# EasyEDA schematic Spring+ - Schematic.json
TITLE: Spring+ Avionics Control-Board; REV: 1.0; Date: 2021-11-15; Sheet: 1/1; Company: Lrocket
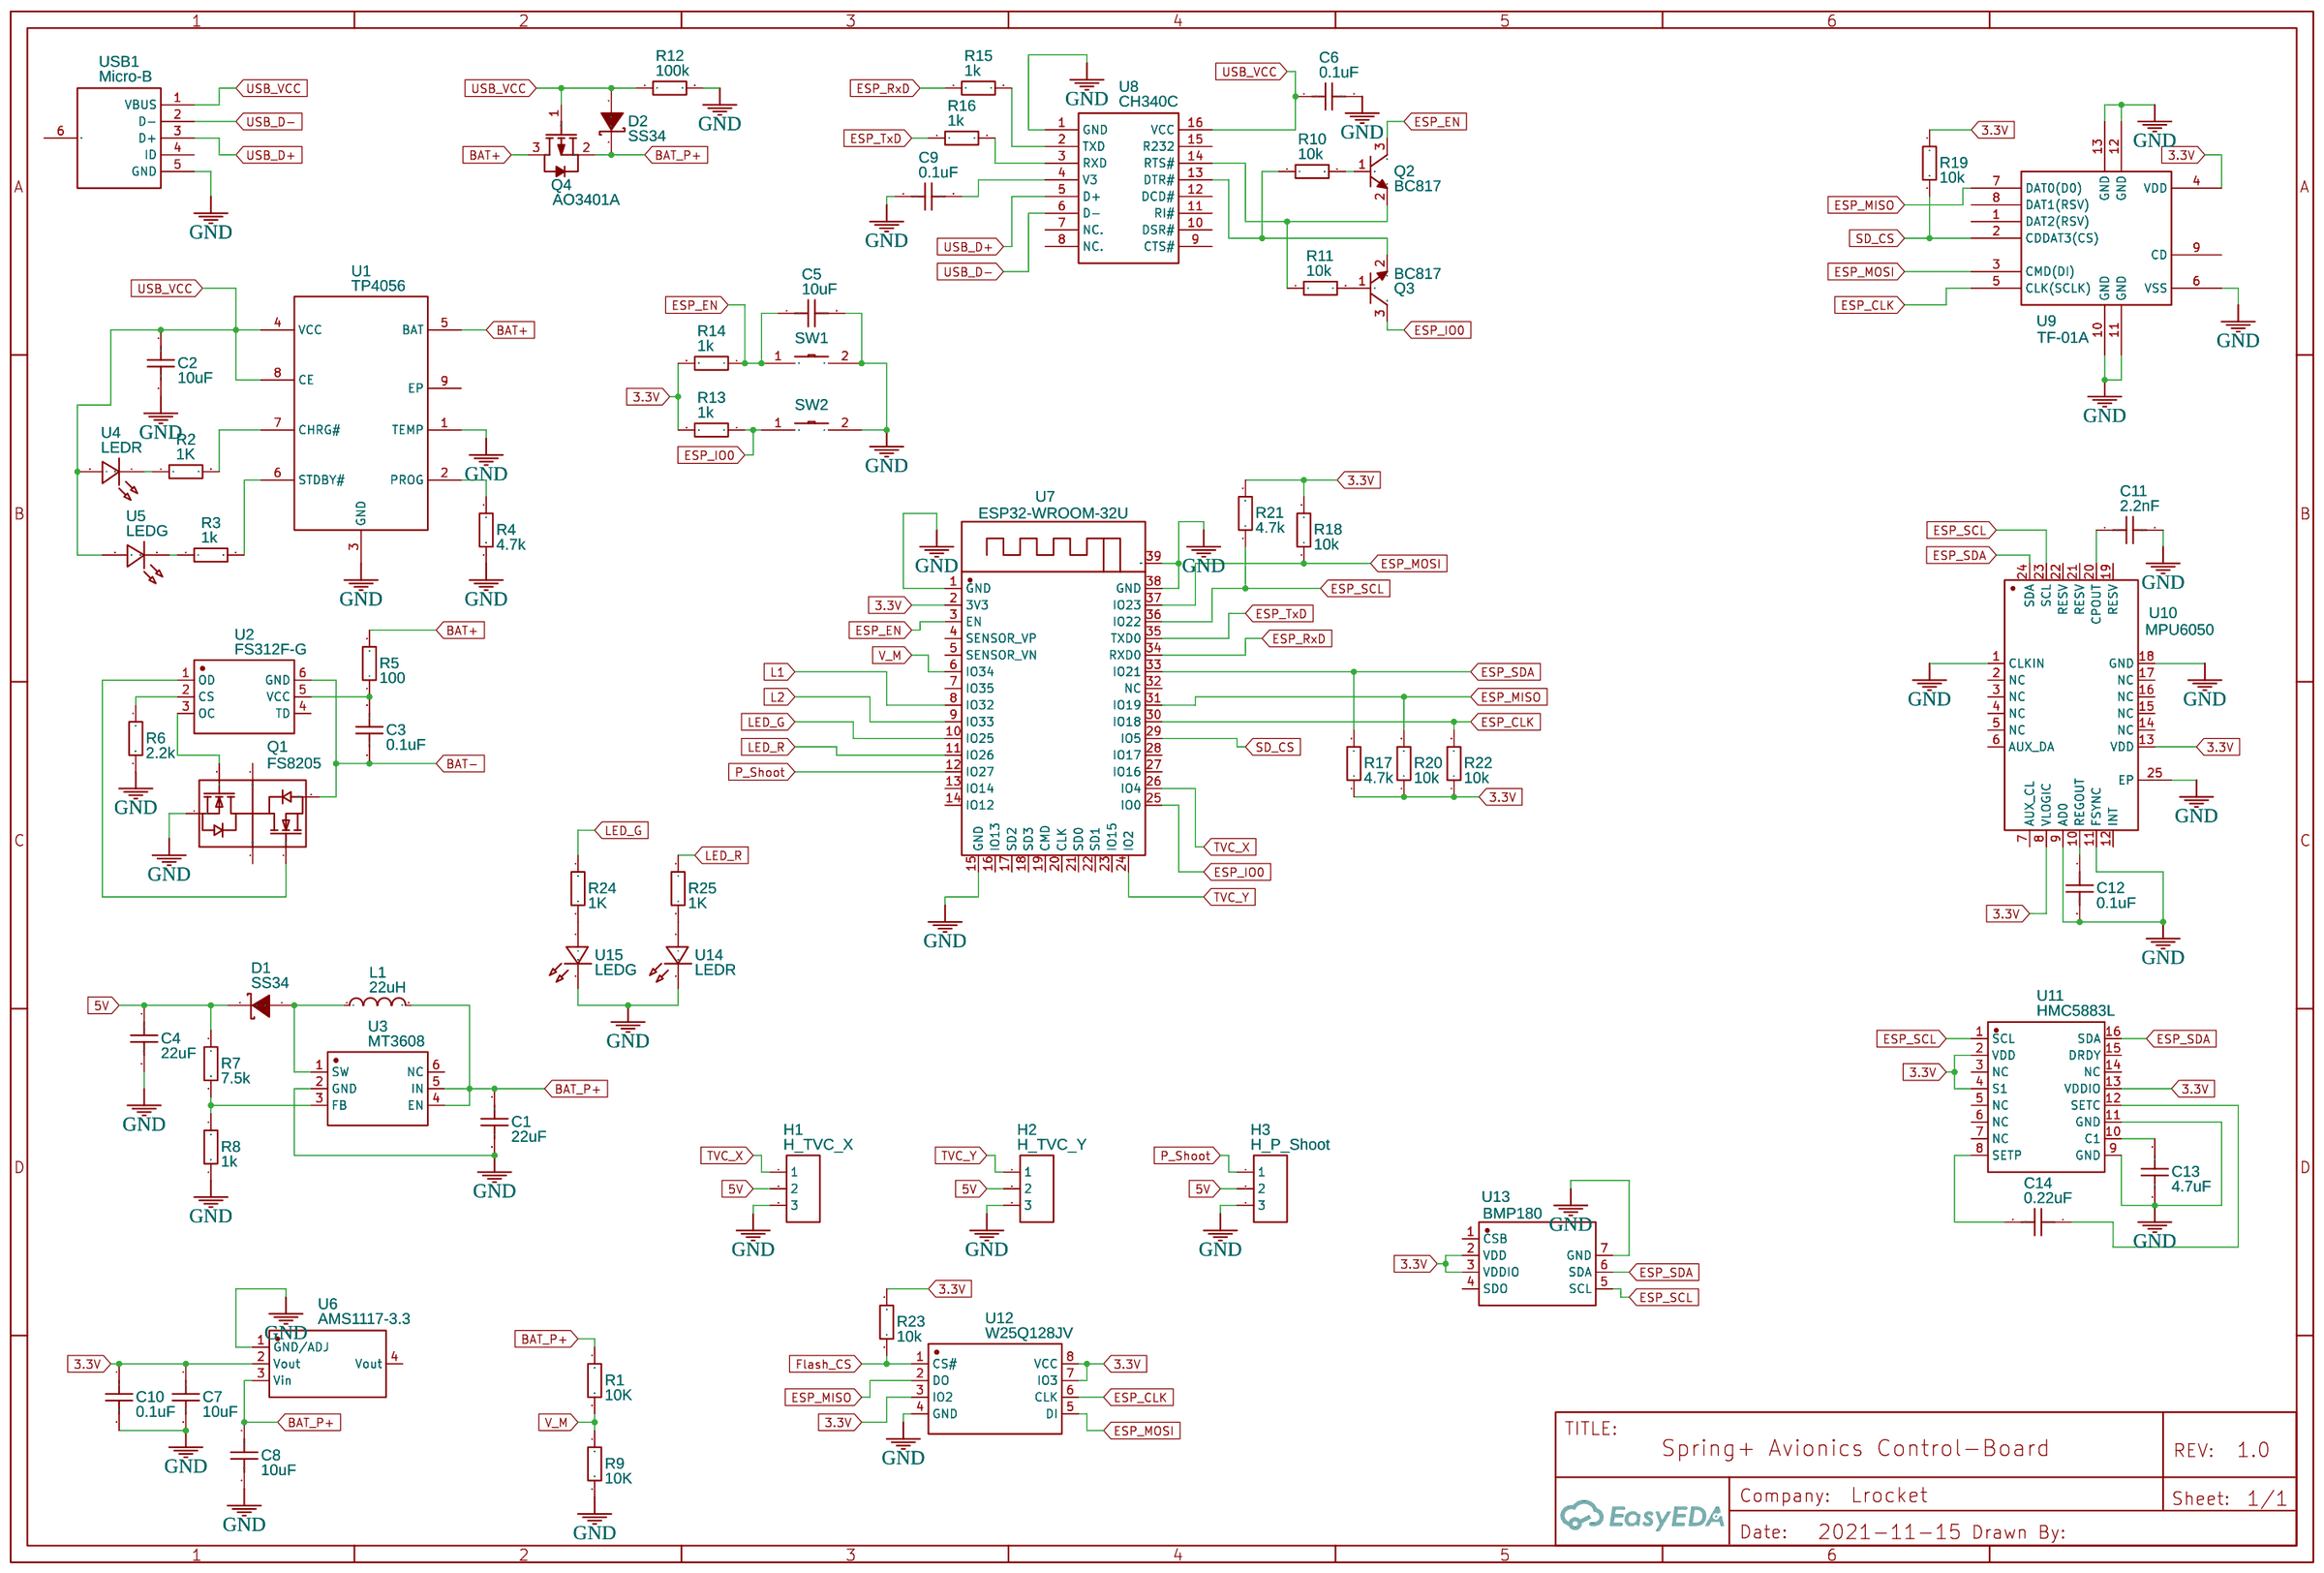
[diagram p0: schematic sheet]

## Parts
C1  22uF  [C1206]
C2  10uF  [C1206]
C3  0.1uF  [C1206]
C4  22uF  [C1206]
C5  10uF  [C1206]
C6  0.1uF  [C1206]
C7  10uF  [C1206]
C8  10uF  [C1206]
C9  0.1uF  [C1206]
C10  0.1uF  [C1206]
C11  2.2nF  [C1206]
C12  0.1uF  [C1206]
C13  4.7uF  [C1206]
C14  0.22uF  [C1206]
D1  SS34  [SMC_L7.1-W6.2-LS8.1-R-RD]
D2  SS34  [SMC_L7.1-W6.2-LS8.1-R-RD]
H1  H_TVC_X  [HDR-TH_3P-P2.54-V-M-1]
H2  H_TVC_Y  [HDR-TH_3P-P2.54-V-M-1]
H3  H_P_Shoot  [HDR-TH_3P-P2.54-V-M-1]
L1  22uH  [IND-SMD_L7.0-W6.6_FXL0630]
Q1  FS8205  [SOT-23-6_L2.9-W1.6-P0.95-LS2.8-BR]
Q2  BC817  [SOT-23-3_L2.9-W1.6-P1.90-LS2.8-BR]
Q3  BC817  [SOT-23-3_L2.9-W1.6-P1.90-LS2.8-BR]
Q4  AO3401A  [SOT-23_L2.9-W1.3-P1.90-LS2.4-BR]
R1  10K  [R1206]
R2  1K  [R1206]
R3  1k  [R1206]
R4  4.7k  [R1206]
R5  100  [R1206]
R6  2.2k  [R1206]
R7  7.5k  [R1206]
R8  1k  [R1206]
R9  10K  [R1206]
R10  10k  [R1206]
R11  10k  [R1206]
R12  100k  [R1206]
R13  1k  [R1206]
R14  1k  [R1206]
R15  1k  [R1206]
R16  1k  [R1206]
R17  4.7k  [R1206]
R18  10k  [R1206]
R19  10k  [R1206]
R20  10k  [R1206]
R21  4.7k  [R1206]
R22  10k  [R1206]
R23  10k  [R1206]
R24  1K  [R1206]
R25  1K  [R1206]
SW1  TS-1101-C-W  [SW-SMD_L6.0-W3.3-LS8.0]
SW2  TS-1101-C-W  [SW-SMD_L6.0-W3.3-LS8.0]
U1  TP4056  [ESOP-8_L4.9-W3.9-P1.27-LS6.0-BL-EP]
U2  FS312F-G  [SOT-23-6_L2.9-W1.6-P0.95-LS2.8-BR]
U3  MT3608  [SOT-23-6_L2.9-W1.6-P0.95-LS2.8-BR]
U4  LEDR  [LED1206-RD]
U5  LEDG  [LED1206-RD]
U6  AMS1117-3.3  [SOT-223-3_L6.5-W3.4-P2.30-LS7.0-BR]
U7  ESP32-WROOM-32U  [WIFIM-SMD_38P-L19.2-W18.0-P1.27]
U8  CH340C  [SOP-16_L10.0-W3.9-P1.27-LS6.0-BL]
U9  TF-01A  [TF-SMD_TF-01A]
U10  MPU6050  [QFN-24_L4.0-W4.0-P0.50-BL-EP2.7]
U11  HMC5883L  [LPCC-16_L3.0-W3.0-P0.50-BL]
U12  W25Q128JV  [SOIC-8_L5.3-W5.3-P1.27-LS8.0-BL]
U13  BMP180  [LGA-7_L3.8-W3.6-P1.50-BL]
U14  LEDR  [LED1206-RD]
U15  LEDG  [LED1206-RD]
USB1  Micro-B  [MICRO-USB-SMD_U254-051T-4BH83-S1S]

## Library data of the parts
C1-C14 = C1206X5R106K500NT: Supplier: LCSC; Supplier Part: C466808; Manufacturer: SANYEAR; Contributor: LCSC
D1 D2 = SS34: Supplier: LCSC; Manufacturer: MDD; Supplier Part: C13763; JLCPCB Part Class: Extended Part
H1-H3 = Header-Male-2.54_1x3: Supplier: LCSC; Manufacturer: BOOMELE; Manufacturer Part: Header2.54mm 1*3P; Supplier Part: C49257; JLCPCB Part Class: Extended Part
L1 = FXL0630-220-M: Supplier: LCSC; Supplier Part: C177244; Manufacturer: Changjiang Microelectronics Tech; Contributor: LCSC; JLCPCB Part Class: Extended Part
Q1 = FS8205: Supplier: LCSC; Manufacturer: FORTUNE; Supplier Part: C32254; JLCPCB Part Class: Basic Part
Q2 Q3 = BC817-25: Supplier: LCSC; Manufacturer: CJ; Supplier Part: C8588; JLCPCB Part Class: Extended Part
Q4 = AO3401A: Supplier: LCSC; Manufacturer: AOS; Supplier Part: C15127; JLCPCB Part Class: Basic Part
R1-R25 = RMCF1206JT10K0: Supplier: LCSC; Supplier Part: C237800; Manufacturer: Stackpole Elec; Contributor: LCSC; JLCPCB Part Class: Extended Part
SW1 SW2 = TS-1101-C-W: Supplier: LCSC; Supplier Part: C318938; Manufacturer: XKB Connectivity(中国星坤); Contributor: LCSC; JLCPCB Part Class: Extended Part
U1 = TP4056: Contributor: Guest; Supplier: LCSC; Manufacturer: TOPPOWER; Supplier Part: C16581; JLCPCB Part Class: Basic Part
U2 = FS312F-G: Supplier: LCSC; Manufacturer: FORTUNE; Supplier Part: C82736; JLCPCB Part Class: Extended Part
U3 = MT3608: Supplier: LCSC; Manufacturer: AEROSEMI; Supplier Part: C84817; JLCPCB Part Class: Extended Part
U4 U5 U14 U15 = SFH 2701: Supplier: LCSC; Supplier Part: C66361; Manufacturer: OSRAM; Contributor: LCSC
U6 = AMS1117-3.3: sourceId: dwIGgezVh; Supplier: LCSC; Manufacturer: AMS; Supplier Part: C6186; JLCPCB Part Class: Basic Part
U7 = ESP32-WROOM-32U: Supplier: LCSC; Supplier Part: C328062; Manufacturer: Espressif Systems; Contributor: LCSC; JLCPCB Part Class: Extended Part
U8 = CH340C: Supplier: LCSC; Manufacturer: WCH; Supplier Part: C84681; JLCPCB Part Class: Extended Part
U9 = TF-01A: Supplier: LCSC; Manufacturer: HRO; Supplier Part: C91145; JLCPCB Part Class: Extended Part
U10 = MPU6050-YJLTY: Supplier: LCSC; Supplier Part: C2912107; Manufacturer: null; JLCPCB Part Class: Extended Part; Contributor: LCSC
U11 = HMC5883L: Supplier: LCSC; Supplier Part: C2859540; Manufacturer: null; JLCPCB Part Class: Extended Part; Contributor: LCSC
U12 = W25Q128JVSIQTR: Supplier: LCSC; Manufacturer: WINBOND; Supplier Part: C97521; JLCPCB Part Class: Basic Part
U13 = BMP180: Supplier: LCSC; Supplier Part: C438474; Manufacturer: Bosch Sensortec; Contributor: LCSC; JLCPCB Part Class: Extended Part
USB1 = U254-051T-4BH83-S1S: Supplier: LCSC; Supplier Part: C319160; Manufacturer: XKB Enterprise; Contributor: LCSC; JLCPCB Part Class: Extended Part

## Nets
3.3V: C7.1 C10.1 R13.2 R14.2 R17.1 R18.2 R19.1 R20.1 R21.2 R22.1 R23.2 U6.2(Vout) U7.2(3V3) U9.4(VDD) U10.8(VLOGIC) U10.13(VDD) U11.2(VDD) U11.4(S1) U11.13(VDDIO) U12.3(IO2) U12.7(IO3) U12.8(VCC) U13.2(VDD) U13.3(VDDIO)
5V: C4.1 D1.2(K) H1.2 H2.2 H3.2 R7.1
GND: C1.2 C2.2 C4.2 C5.2 C6.2 C7.2 C8.2 C9.1 C10.2 C11.2 C12.2 C13.1 H1.3 H2.3 H3.3 Q1.1(S1) R4.2 R6.2 R8.2 R9.2 R12.2 SW1.2 SW2.2 U1.1(TEMP) U1.3(GND) U3.2(GND) U6.1(GND/ADJ) U7.1(GND) U7.15(GND) U7.38(GND) U7.39(GND) U8.1(GND) U9.6(VSS) U9.10(GND) U9.11(GND) U9.12(GND) U9.13(GND) U10.1(CLKIN) U10.9(AD0) U10.11(FSYNC) U10.18(GND) U10.25(EP) U11.9(GND) U11.11(GND) U12.4(GND) U13.7(GND) U14.1(C) U15.1(C) USB1.5(GND)
BAT+: Q4.3(D) R5.2 U1.5(BAT)
BAT-: C3.1 Q1.3(S2) U2.6(GND)
BAT_P+: C1.1 C8.1 D2.2(K) L1.2 Q4.2(S) R1.1 U3.4(EN) U3.5(IN) U6.3(Vin)
ESP_CLK: R22.2 U7.30(IO18) U9.5(CLK(SCLK)) U12.6(CLK)
ESP_EN: C5.1 Q2.3(C) R14.1 SW1.1 U7.3(EN)
ESP_IO0: Q3.3(C) R13.1 SW2.1 U7.25(IO0)
ESP_MISO: R20.2 U7.31(IO19) U9.7(DAT0(D0)) U12.2(DO)
ESP_MOSI: R18.1 U7.37(IO23) U9.3(CMD(DI)) U12.5(DI)
ESP_RxD: R15.1 U7.34(RXD0)
ESP_SCL: R21.1 U7.36(IO22) U10.23(SCL) U11.1(SCL) U13.5(SCL)
ESP_SDA: R17.2 U7.33(IO21) U10.24(SDA) U11.16(SDA) U13.6(SDA)
ESP_TxD: R16.1 U7.35(TXD0)
Flash_CS: R23.1 U12.1(CS#)
L1: U7.8(IO32)
L2: U7.9(IO33)
LED_G: R24.1 U7.10(IO25)
LED_R: R25.1 U7.11(IO26)
P_Shoot: H3.1 U7.12(IO27)
SD_CS: R19.2 U7.29(IO5) U9.2(CDDAT3(CS))
TVC_X: H1.1 U7.26(IO4)
TVC_Y: H2.1 U7.24(IO2)
USB_D+: U8.5(D+) USB1.3(D+)
USB_D-: U8.6(D-) USB1.2(D-)
USB_VCC: C2.1 C6.1 D2.1(A) Q4.1(G) R12.1 U1.4(VCC) U1.8(CE) U4.2(A) U5.2(A) U8.16(VCC) USB1.1(VBUS)
V_M: R1.2 R9.1 U7.6(IO34)
Net-(C3-2): C3.2 R5.1 U2.5(VCC)
Net-(C9-2): C9.2 U8.4(V3)
Net-(C11-1): C11.1 U10.20(CPOUT)
Net-(C12-1): C12.1 U10.10(REGOUT)
Net-(C13-2): C13.2 U11.10(C1)
Net-(C14-1): C14.1 U11.12(SETC)
Net-(C14-2): C14.2 U11.8(SETP)
Net-(D1-1): D1.1(A) L1.1 U3.1(SW)
Net-(Q1-4): Q1.4(G2) U2.1(OD)
Net-(Q1-6): Q1.6(G1) U2.3(OC)
Net-(Q2-1): Q2.1(B) R10.2
Net-(Q2-2): Q2.2(E) R11.1 U8.14(RTS#)
Net-(Q3-1): Q3.1(B) R11.2
Net-(Q3-2): Q3.2(E) R10.1 U8.13(DTR#)
Net-(R2-1): R2.1 U4.1(C)
Net-(R2-2): R2.2 U1.7(CHRG#)
Net-(R3-1): R3.1 U5.1(C)
Net-(R3-2): R3.2 U1.6(STDBY#)
Net-(R4-1): R4.1 U1.2(PROG)
Net-(R6-1): R6.1 U2.2(CS)
Net-(R7-2): R7.2 R8.1 U3.3(FB)
Net-(R15-2): R15.2 U8.2(TXD)
Net-(R16-2): R16.2 U8.3(RXD)
Net-(R24-2): R24.2 U15.2(A)
Net-(R25-2): R25.2 U14.2(A)

Not connected (* = marked no-connect by the designer): Q1 2(D12) 5(D12); U1 9(EP); U2 4(TD); U3 6(NC); U6 4(Vout); U7 4(SENSOR_VP) 5(SENSOR_VN) 7(IO35) 13(IO14) 14(IO12) 16(IO13) 17(SD2) 18(SD3) 19(CMD) 20(CLK) 21(SD0) 22(SD1) 23(IO15) 27(IO16) 28(IO17) 32(NC); U8 7(NC.) 8(NC.) 9(CTS#) 10(DSR#) 11(RI#) 12(DCD#) 15(R232); U9 1(DAT2(RSV)) 8(DAT1(RSV)) 9(CD); U10 2(NC) 3(NC) 4(NC) 5(NC) 6(AUX_DA) 7(AUX_CL) 12(INT) 14(NC) 15(NC) 16(NC) 17(NC) 19(RESV) 21(RESV) 22(RESV); U11 3(NC) 5(NC) 6(NC) 7(NC) 14(NC) 15(DRDY); U13 1(CSB) 4(SDO); USB1 4(ID) 6(EH)
